# Altium schematic sheet Prepheral.SchDoc
size A4; SheetNumber: 9; SheetTotal: 12
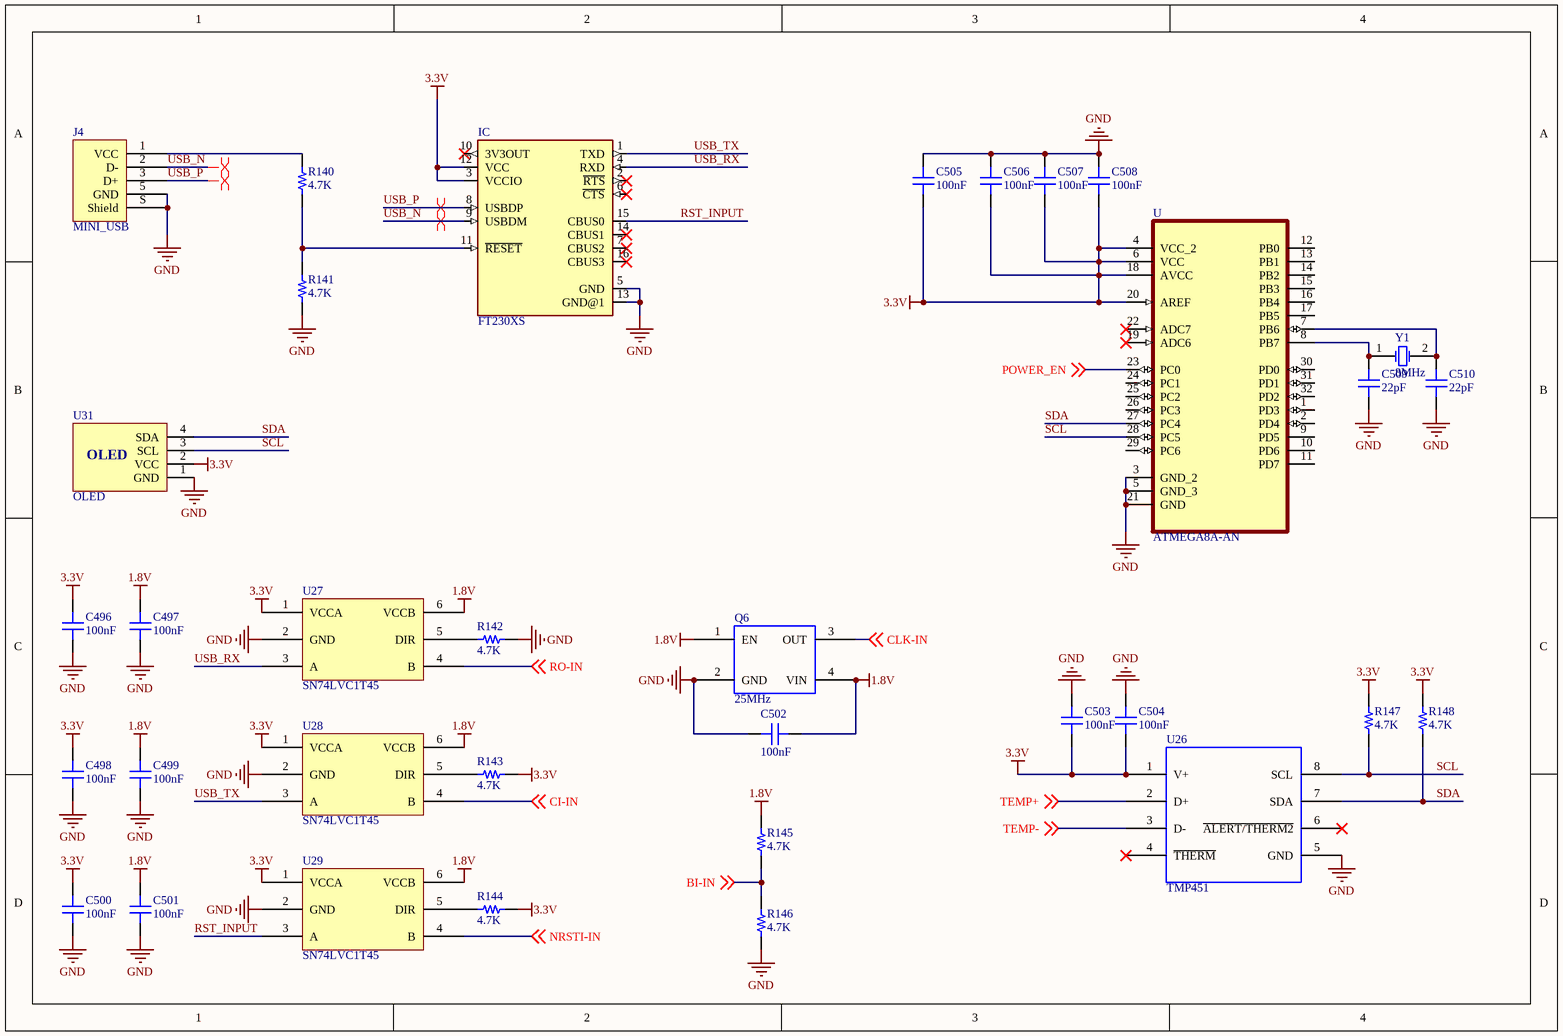
[diagram p0: Prepheral.SchDoc]

## Parts
C496  100nF  [CAP-SMD-0603]
C497  100nF  [CAP-SMD-0603]
C498  100nF  [CAP-SMD-0603]
C499  100nF  [CAP-SMD-0603]
C500  100nF  [CAP-SMD-0603]
C501  100nF  [CAP-SMD-0603]
C502  100nF  [CAP_SMD_0805]
C503  100nF  [CAP_SMD_0805]
C504  100nF  [CAP_SMD_0805]
C505  100nF  [CAP_SMD_0805]
C506  100nF  [CAP_SMD_0805]
C507  100nF  [CAP_SMD_0805]
C508  100nF  [CAP_SMD_0805]
C509  22pF  [CAP_SMD_0805]
C510  22pF  [CAP_SMD_0805]
IC  FT230XS  [SSOP16]
J4  MINI_USB  [Mini_usb]
Q6  25MHz  [XTALL]
R140  4.7K  [RES-SMD-0603]
R141  4.7K  [RES-SMD-0603]
R142  4.7K  [RES-SMD-0603]
R143  4.7K  [RES-SMD-0603]
R144  4.7K  [RES-SMD-0603]
R145  4.7K  [RES-SMD-0603]
R146  4.7K  [RES-SMD-0603]
R147  4.7K  [RES-SMD-0603]
R148  4.7K  [RES-SMD-0603]
U  ATMEGA8A-AN  [QFP80P900X900X120-32N]
U26  TMP451  [SON50P200X200X80-9N]
U27  SN74LVC1T45  [SOT23-6PIN]
U28  SN74LVC1T45  [SOT23-6PIN]
U29  SN74LVC1T45  [SOT23-6PIN]
U31  OLED  [OLED]
Y1  8MHz  [XTAL_SMD]

## Nets
1.8V: C497.2 C499.2 C501.2 C502.2 Q6.1(EN) Q6.4(VIN) R145.1 U27.6(VCCB) U28.6(VCCB) U29.6(VCCB)
3.3V: C496.2 C498.2 C500.2 C503.1 C504.1 C505.1 C506.1 C507.1 C508.1 IC.3(VCCIO) IC.12(VCC) R143.1 R144.1 R147.2 R148.2 U.4(VCC_2) U.6(VCC) U.18(AVCC) U.20(AREF) U26.1(V+) U27.1(VCCA) U28.1(VCCA) U29.1(VCCA) U31.2(VCC)
GND: C496.1 C497.1 C498.1 C499.1 C500.1 C501.1 C502.1 C503.2 C504.2 C505.2 C506.2 C507.2 C508.2 C509.1 C510.1 IC.5(GND) IC.13(GND@1) J4.5(GND) J4.S(Shield) Q6.2(GND) R141.1 R142.1 R146.2 U.3(GND_2) U.5(GND_3) U.21(GND) U26.5(GND) U27.2(GND) U28.2(GND) U29.2(GND) U31.1(GND)
BI-IN: R145.2 R146.1 ; off-sheet BI-IN
CI-IN: U28.4(B) ; off-sheet CI-IN
CLK-IN: Q6.3(OUT) ; off-sheet CLK-IN
NRSTI-IN: U29.4(B) ; off-sheet NRSTI-IN
POWER_EN: U.23(PC0) ; off-sheet POWER_EN
RO-IN: U27.4(B) ; off-sheet RO-IN
RST_INPUT: IC.15(CBUS0) U29.3(A)
SCL: R147.1 U.28(PC5) U26.8(SCL) U31.3(SCL)
SDA: R148.1 U.27(PC4) U26.7(SDA) U31.4(SDA)
TEMP+: U26.2(D+) ; off-sheet TEMP+
TEMP-: U26.3(D-) ; off-sheet TEMP-
USB_N: IC.9(USBDM) J4.2(D-)
USB_P: IC.8(USBDP) J4.3(D+)
USB_RX: IC.4(RXD) U27.3(A)
USB_TX: IC.1(TXD) U28.3(A)
NetC509_2: C509.2 U.8(PB7) Y1.1(OSC1)
NetC510_2: C510.2 U.7(PB6) Y1.2(OSC2)
NetIC_11: IC.11(~{RESET}) R140.1 R141.2
NetJ4_1: J4.1(VCC) R140.2
NetR142_2: R142.2 U27.5(DIR)
NetR143_2: R143.2 U28.5(DIR)
NetR144_2: R144.2 U29.5(DIR)

Not connected (* = marked no-connect by the designer): IC 2(~{RTS})* 6(~{CTS})* 7(CBUS2)* 10(3V3OUT)* 14(CBUS1)* 16(CBUS3)*; U 1(PD3) 2(PD4) 9(PD5) 10(PD6) 11(PD7) 12(PB0) 13(PB1) 14(PB2) 15(PB3) 16(PB4) 17(PB5) 19(ADC6)* 22(ADC7)* 24(PC1) 25(PC2) 26(PC3) 29(PC6) 30(PD0) 31(PD1) 32(PD2); U26 4(~{THERM})* 6(~{ALERT/THERM2})*

## Layout directives
differential pair: USB_N, USB_P

## Library data of the parts
C496-C510 = CAP
IC = FT230XS: USB Bridge, USB to UART USB 2.0 UART Interface 16-SSOP; MF: FTDI, Future; MP: FT230XS; Price: None; Availability: Unavailable; Package: SSOP-16 FTDI; SnapEDA_Link: https://www.snapeda.com/parts/FT230XS/FTDI%2C%20Future%20Technology%20Devices%20International%20Ltd/view-part/433817/?ref=snap; Value: *
Q6 = OSCILLATOR
R140-R148 = RES
U = ATMEGA8A-AN: AVR AVRÂ® ATmega Microcontroller IC 8-Bit 16MHz 8KB (4K x 16) FLASH 32-TQFP (7x7); MF: Microchip; SnapEDA_Link: https://www.snapeda.com/parts/ATMEGA8A-AN/Microchip/view-part/883838/?ref=snap; Value: *; MP: ATMEGA8A-AN; DigiKey-Purchase-URL: https://snapeda.com/shop?store=DigiKey&id=883838; Package: TQFP-32 Microchip; Price: None; Availability: Warning; Mouser-Purchase-URL: https://snapeda.com/shop?store=Mouser&id=883838
Y1 = XTAL: Crystal Oscillator; Published: 8-Jun-2000; LatestRevisionDate: 17-Jul-2002; LatestRevisionNote: Re-released for DXP Platform.; PackageReference: R38; Publisher: Altium Limited; PackageDescription: Crystal, Thru-Hole; 2 Leads; Body 3.1 x 8.2 mm (Dia.xH); Value: 8MHz